# Altium schematic sheet Control_Panel.SchDoc: Наименование
size 420 x 297 mm; ApprovedBy: Сидоров; CheckedBy: Петров; Author: Иванов; CompanyName: РГППУ; Title2str: Изделия; DecimalNumber: АБВГ.123456.001 33
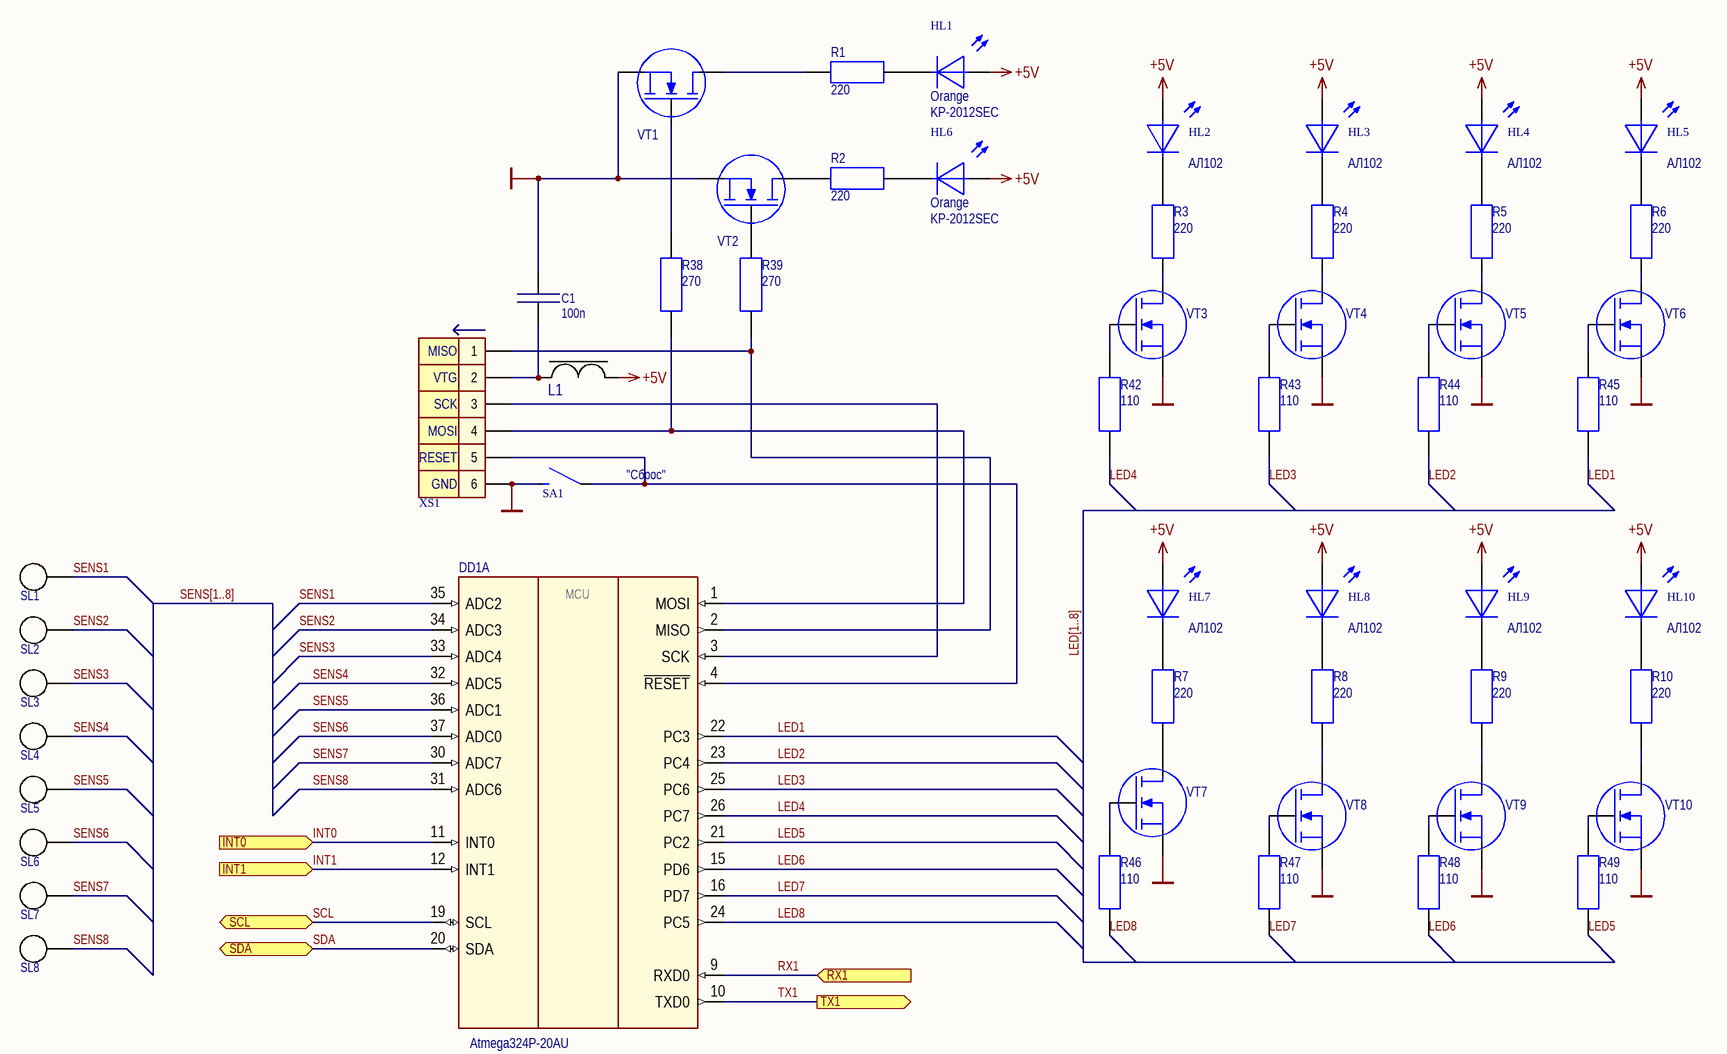
[diagram p0: Control_Panel.SchDoc]

## Parts
C1  100n  [SMDRC0805]
DD1  Atmega324P-20AU  [44ML_M]  (part A of 2)
HL1  Orange  ManufacturerPartNumber: KP-2012SEC  [DIOMELF2012M]
HL2  ManufacturerPartNumber: АЛ102  [LED_diode]
HL3  ManufacturerPartNumber: АЛ102  [LED_diode]
HL4  ManufacturerPartNumber: АЛ102  [LED_diode]
HL5  ManufacturerPartNumber: АЛ102  [LED_diode]
HL6  Orange  ManufacturerPartNumber: KP-2012SEC  [DIOMELF2012M]
HL7  ManufacturerPartNumber: АЛ102  [LED_diode]
HL8  ManufacturerPartNumber: АЛ102  [LED_diode]
HL9  ManufacturerPartNumber: АЛ102  [LED_diode]
HL10  ManufacturerPartNumber: АЛ102  [LED_diode]
L1  MPZ1608S181A  [INDC0603X03M]  (value not drawn)
R1  220  [SMDRC0805]
R2  220  [SMDRC0805]
R3  220  [SMDRC0805]
R4  220  [SMDRC0805]
R5  220  [SMDRC0805]
R6  220  [SMDRC0805]
R7  220  [SMDRC0805]
R8  220  [SMDRC0805]
R9  220  [SMDRC0805]
R10  220  [SMDRC0805]
R38  270  [SMDRC0805]
R39  270  [SMDRC0805]
R42  110  [SMDRC0805]
R43  110  [SMDRC0805]
R44  110  [SMDRC0805]
R45  110  [SMDRC0805]
R46  110  [SMDRC0805]
R47  110  [SMDRC0805]
R48  110  [SMDRC0805]
R49  110  [SMDRC0805]
SA1  DTSM20-4.3  [DTSM20]  (value not drawn)
SL1  Touch_sensor  [Bolt 6mm]  (value not drawn)
SL2  Touch_sensor  [Bolt 6mm]  (value not drawn)
SL3  Touch_sensor  [Bolt 6mm]  (value not drawn)
SL4  Touch_sensor  [Bolt 6mm]  (value not drawn)
SL5  Touch_sensor  [Bolt 6mm]  (value not drawn)
SL6  Touch_sensor  [Bolt 6mm]  (value not drawn)
SL7  Touch_sensor  [Bolt 6mm]  (value not drawn)
SL8  Touch_sensor  [Bolt 6mm]  (value not drawn)
VT1  2N7002  [SOT23 (TO-236AB)]  (value not drawn)
VT2  2N7002  [SOT23 (TO-236AB)]  (value not drawn)
VT3  2N7002  [SOT23 (TO-236AB)]  (value not drawn)
VT4  2N7002  [SOT23 (TO-236AB)]  (value not drawn)
VT5  2N7002  [SOT23 (TO-236AB)]  (value not drawn)
VT6  2N7002  [SOT23 (TO-236AB)]  (value not drawn)
VT7  2N7002  [SOT23 (TO-236AB)]  (value not drawn)
VT8  2N7002  [SOT23 (TO-236AB)]  (value not drawn)
VT9  2N7002  [SOT23 (TO-236AB)]  (value not drawn)
VT10  2N7002  [SOT23 (TO-236AB)]  (value not drawn)
XS1  IDC-06M  [IDC-06M]  (value not drawn)

## Ports
INT0 (in), INT1 (in), RX1 (in), SCL (bidir), SDA (bidir), TX1 (out)

## Nets
+5V: HL1.1 HL2.A HL3.A HL4.A HL5.A HL6.1 HL7.A HL8.A HL9.A HL10.A L1.1
GND: C1.2 SA1.2 VT1.2(S) VT2.2(S) VT3.2(S) VT4.2(S) VT5.2(S) VT6.2(S) VT7.2(S) VT8.2(S) VT9.2(S) VT10.2(S) XS1.6
INT0: DD1.11(INT0) ; port INT0
INT1: DD1.12(INT1) ; port INT1
LED1: DD1.22(PC3) R45.1
LED2: DD1.23(PC4) R44.1
LED3: DD1.25(PC6) R43.1
LED4: DD1.26(PC7) R42.1
LED5: DD1.21(PC2) R49.1
LED6: DD1.15(PD6) R48.1
LED7: DD1.16(PD7) R47.1
LED8: DD1.24(PC5) R46.1
RX1: DD1.9(RXD0) ; port RX1
SCL: DD1.19(SCL) ; port SCL
SDA: DD1.20(SDA) ; port SDA
SENS1: DD1.35(ADC2) SL1.1
SENS2: DD1.34(ADC3) SL2.1
SENS3: DD1.33(ADC4) SL3.1
SENS4: DD1.32(ADC5) SL4.1
SENS5: DD1.36(ADC1) SL5.1
SENS6: DD1.37(ADC0) SL6.1
SENS7: DD1.30(ADC7) SL7.1
SENS8: DD1.31(ADC6) SL8.1
TX1: DD1.10(TXD0) ; port TX1
NetC1_1: C1.1 L1.2 XS1.2
NetDD1_1: DD1.1(MOSI) R38.1 XS1.4
NetDD1_2: DD1.2(MISO) R39.1 XS1.1
NetDD1_3: DD1.3(SCK) XS1.3
NetDD1_4: DD1.4(~{RESET}) SA1.1 XS1.5
NetHL1_2: HL1.2 R1.2
NetHL2_K: HL2.K R3.2
NetHL3_K: HL3.K R4.2
NetHL4_K: HL4.K R5.2
NetHL5_K: HL5.K R6.2
NetHL6_2: HL6.2 R2.2
NetHL7_K: HL7.K R7.2
NetHL8_K: HL8.K R8.2
NetHL9_K: HL9.K R9.2
NetHL10_K: HL10.K R10.2
NetR1_1: R1.1 VT1.3(D)
NetR2_1: R2.1 VT2.3(D)
NetR3_1: R3.1 VT3.3(D)
NetR4_1: R4.1 VT4.3(D)
NetR5_1: R5.1 VT5.3(D)
NetR6_1: R6.1 VT6.3(D)
NetR7_1: R7.1 VT7.3(D)
NetR8_1: R8.1 VT8.3(D)
NetR9_1: R9.1 VT9.3(D)
NetR10_1: R10.1 VT10.3(D)
NetR38_2: R38.2 VT1.1(G)
NetR39_2: R39.2 VT2.1(G)
NetR42_2: R42.2 VT3.1(G)
NetR43_2: R43.2 VT4.1(G)
NetR44_2: R44.2 VT5.1(G)
NetR45_2: R45.2 VT6.1(G)
NetR46_2: R46.2 VT7.1(G)
NetR47_2: R47.2 VT8.1(G)
NetR48_2: R48.2 VT9.1(G)
NetR49_2: R49.2 VT10.1(G)

## Buses and harness runs
bus LED[1..8]
bus SENS[1..8]

## Notes on the sheet
- (near SA1) "Сброс"
- Изм.
- Лист
- N*докум.
- Подп.
- Дата
- Лит.
- Масса
- Масштаб
- Разраб.
- Пров.
- Т.контр.
- Лиcт
- Лиcтов
- Н.контр.
- Утв.
- (in symbol Atmega324P-20AU, part A) MCU
- (in symbol Con6_M IDC-06M_SPI) MISO; VTG; SCK; MOSI; RESET; GND

## Library data of the parts
C1 = Capacitor 0805 100n: Generic capasitor non-polar; PartNumber: Capacitor 0805 100n; Value: 100n; ComponentLink1Description: Datasheet; Package: 0805
DD1 = Atmega324P-20AU: Microcontroller 8-bit; Manufacturer: Atmel; ComponentLink1URL: http://www.atmel.com/Images/Atmel-8011-8-bit-AVR-Microcontroller-ATmega164P-324P-644P_datasheet.pdf; ComponentLink1Description: Datasheet; Cost: 220; Package: TQFP-44; Supplier: Промэлектроника; ManufacturerPartNumber: Atmega324P-20AU
HL1 HL6 = LED1_O: Diod LED SMD Orange; ComponentLink1Description: Datasheet; Cost: 4,91; ComponentLink2Description: Datasheet-local; ComponentLink2URL: *; Color: Orange
HL2-HL5 HL7-HL10 = _LED1_АЛ102: Diod LED; Manufacturer: СССР; ComponentLink1Description: Datasheet; Package: штырьевой; ComponentLink2Description: Datasheet-local
L1 = Ferrite Bead: Value: ? мГн; ManufacturerPartNumber: MPZ1608S181A; ComponentLink1Description: Datasheet; Supplier: Промэлектроника; ComponentLink2Description: Datasheet-local; ComponentLink2URL: *
R1-R10 = Resistor 0805 220: Generic resistor; PartNumber: Resistor 0805 220; Value: 220; ComponentLink1URL: http://www.mouser.com/ds/2/447/PYu-RC0402_51_RoHS_L_6_r-8721.pdf; ComponentLink1Description: Datasheet; Package: 0805
R38 R39 = Resistor 0805 270: Generic resistor; PartNumber: Resistor 0805 270; Value: 270; ComponentLink1URL: http://www.mouser.com/ds/2/447/PYu-RC0402_51_RoHS_L_6_r-8721.pdf; ComponentLink1Description: Datasheet; Package: 0805
R42-R49 = Resistor 0805 110: Generic resistor; PartNumber: Resistor 0805 110; Value: 110; ComponentLink1URL: http://www.mouser.com/ds/2/447/PYu-RC0402_51_RoHS_L_6_r-8721.pdf; ComponentLink1Description: Datasheet; Package: 0805
SA1 = Switch1_DTSM20-4.3: Switch open; Manufacturer: Diptronics; ManufacturerPartNumber: DTSM20-4.3; ComponentLink1Description: Datasheet; ComponentLink1URL: http://www.promelec.ru/catalog/407/1291/1323/1/70721/; ComponentLink2Description: Datasheet-local; ComponentLink2URL: *
SL1-SL8 = Touch_sensor: Bolt touch sensor
VT1-VT10 = 2N7002 n-MOSFET: 60V, 300mA N-channel Trench MOSFET; ManufacturerPartNumber: 2N7002
XS1 = Con6_M IDC-06M_SPI: SPI connector; ManufacturerPartNumber: IDC-06M; ComponentLink1Description: Datasheet; ComponentLink1URL: http://www.promelec.ru/catalog/406/1218/1223/1/156430/; ComponentLink2Description: Datasheet-local; ComponentLink2URL: *